# EasyEDA Pro project ProPrj_分电板_2025-04-18.epro

# Schematic Schematic1
Board Name: Board1; Create Date: 2025-04-17; Page Name: P1; Project Name: 分电板; Schematic Name: Schematic1; Update Date: 2025-04-17; Company: 嘉立创EDA; Page Size: A4; Version: V1.0
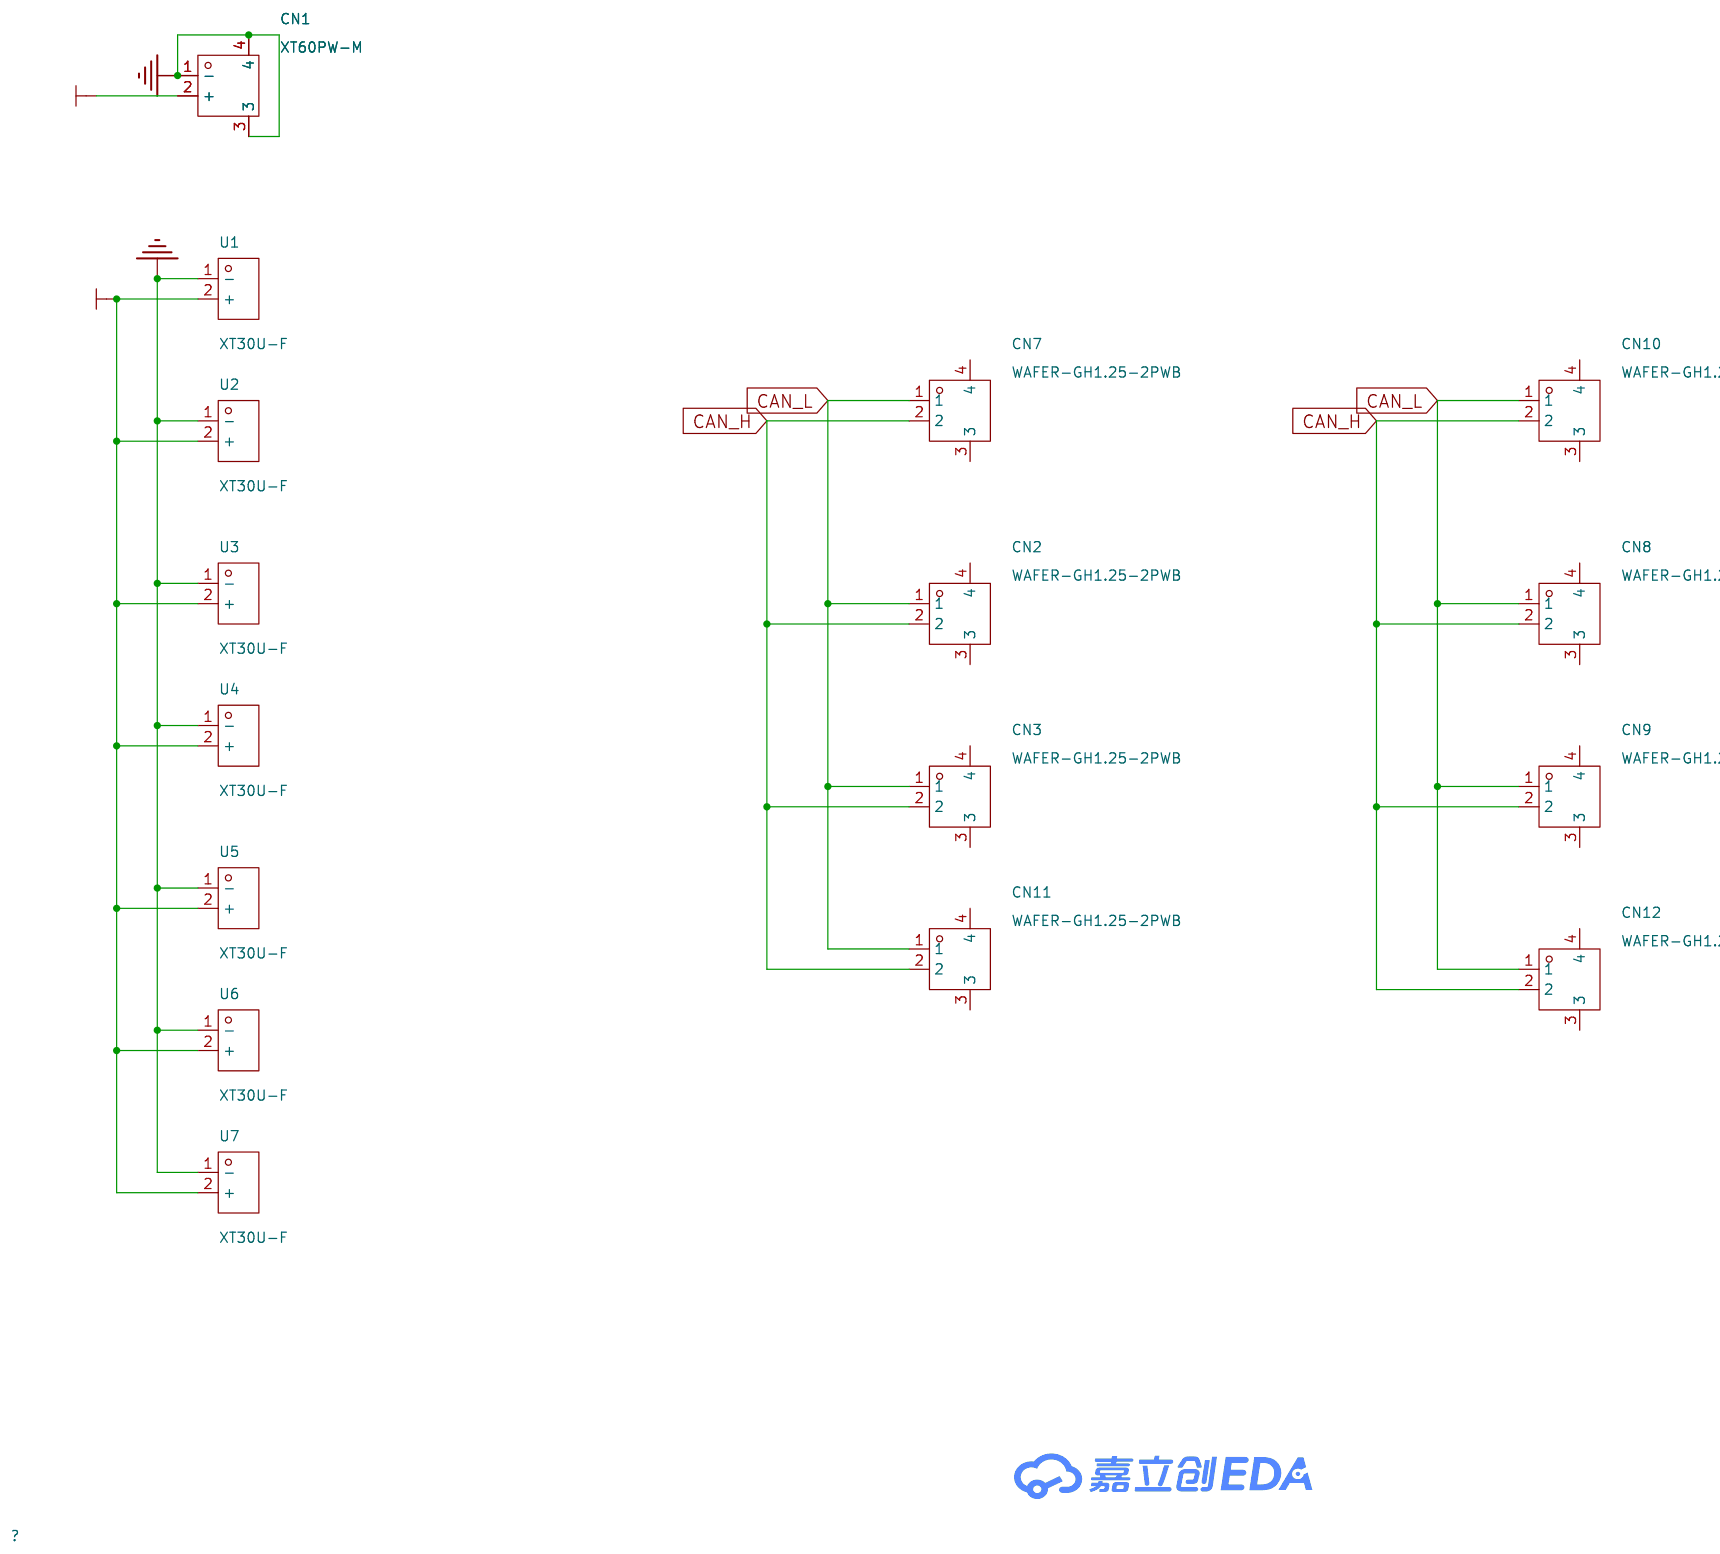
[diagram p0: schematic sheet]

## Parts
CN1  XT60PW-M  [CONN-TH_XT60PW-M]
CN2  WAFER-GH1.25-2PWB  [CONN-TH_2P-P1.25_XUNPU_WAFER-GH1.25-2PWB]
CN3  WAFER-GH1.25-2PWB  [CONN-TH_2P-P1.25_XUNPU_WAFER-GH1.25-2PWB]
CN7  WAFER-GH1.25-2PWB  [CONN-TH_2P-P1.25_XUNPU_WAFER-GH1.25-2PWB]
CN8  WAFER-GH1.25-2PWB  [CONN-TH_2P-P1.25_XUNPU_WAFER-GH1.25-2PWB]
CN9  WAFER-GH1.25-2PWB  [CONN-TH_2P-P1.25_XUNPU_WAFER-GH1.25-2PWB]
CN10  WAFER-GH1.25-2PWB  [CONN-TH_2P-P1.25_XUNPU_WAFER-GH1.25-2PWB]
CN11  WAFER-GH1.25-2PWB  [CONN-TH_2P-P1.25_XUNPU_WAFER-GH1.25-2PWB]
CN12  WAFER-GH1.25-2PWB  [CONN-TH_2P-P1.25_XUNPU_WAFER-GH1.25-2PWB]
U1  XT30U-F  [CONN-TH_XT30U-F]
U2  XT30U-F  [CONN-TH_XT30U-F]
U3  XT30U-F  [CONN-TH_XT30U-F]
U4  XT30U-F  [CONN-TH_XT30U-F]
U5  XT30U-F  [CONN-TH_XT30U-F]
U6  XT30U-F  [CONN-TH_XT30U-F]
U7  XT30U-F  [CONN-TH_XT30U-F]

## Library data of the parts
CN1 = XT60PW-M: 类别:-;类型1:-;; LCSC Part Name: AMASS(艾迈斯)航模插头xt60连接器150公母对接pw锂电池公头 板插卧式XT60PW-M; Supplier Part: C98732; Manufacturer: AMASS(艾迈斯); JLCPCB Part Class: 扩展库; Datasheet: https://atta.szlcsc.com/upload/public/pdf/source/20240118/44A3DCFF53BE25DC65378AFFB21277A4.pdf; Supplier: LCSC; Brand: 艾迈斯; Type: 卧式插头; Colour: 黄色; InterfaceType: 公头
CN2 CN3 CN7-CN12 = WAFER-GH1.25-2PWB: 插针结构:1x2P;间距:1.25mm;安装方式:卧贴;参考系列:GH;总PIN数:2P;排数:1;每排PIN数:2;行距:-;额定电流:1A;触头材质:黄铜;触头镀层:-;工作温度范围:-25℃~+85℃;; LCSC Part Name: 1x2P 间距:1.25mm 卧贴 系列:GH; Supplier Part: C3029377; Manufacturer: XUNPU(讯普); Supplier Footprint: SMD,P=1.25mm,卧贴; JLCPCB Part Class: 扩展库; Datasheet: https://atta.szlcsc.com/upload/public/pdf/source/20220527/CB8773BFB0913C3B8ABD62CB38BA101A.pdf; Supplier: LCSC; Pins Structure: 1x2P; Pitch: 1.25mm; Mounting Type: 卧贴; Reference Series: GH; Number of Pins: 2P; Number of Rows: 1; Number of PINs Per Row: 2; Current Rating: 1A; Contact Material: 黄铜; Operating Temperature: -25℃~+85℃; Voltage Rating: 125V; Plastic Material: LCP; Supplementary Features: 辅助焊脚; Color: 米色; Z-Height of the Board: 4.35mm; X-Length of Bottom Edge on Board (Spacing Line): 5.75mm; Y-Width of Bottom Edge on Board: 5mm
U1-U7 = XT30U-F: 类别:-;类型1:-;; LCSC Part Name: AMASS(艾迈斯)轻量版锂电池插头母头 XT30U-F; Supplier Part: C99102; Manufacturer: AMASS(艾迈斯); JLCPCB Part Class: 扩展库; Datasheet: https://atta.szlcsc.com/upload/public/pdf/source/20190916/C428721_B0ECB8C5937139CEFE8736D2D3175B0E.pdf; Supplier: LCSC; Brand: 艾迈斯; Type: 插头; Colour: 黄色; InterfaceType: 母头

## Nets
GND: CN1.1(-) CN1.3 CN1.4 U1.1(-) U2.1(-) U3.1(-) U4.1(-) U5.1(-) U6.1(-) U7.1(-)
VCC24V: CN1.2(+) U1.2(+) U2.2(+) U3.2(+) U4.2(+) U5.2(+) U6.2(+) U7.2(+)
CAN_H: CN2.2 CN3.2 CN7.2 CN8.2 CN9.2 CN10.2 CN11.2 CN12.2
CAN_L: CN2.1 CN3.1 CN7.1 CN8.1 CN9.1 CN10.1 CN11.1 CN12.1

Not connected (* = marked no-connect by the designer): CN2 3 4; CN3 3 4; CN7 3 4; CN8 3 4; CN9 3 4; CN10 3 4; CN11 3 4; CN12 3 4

# Board PCB1
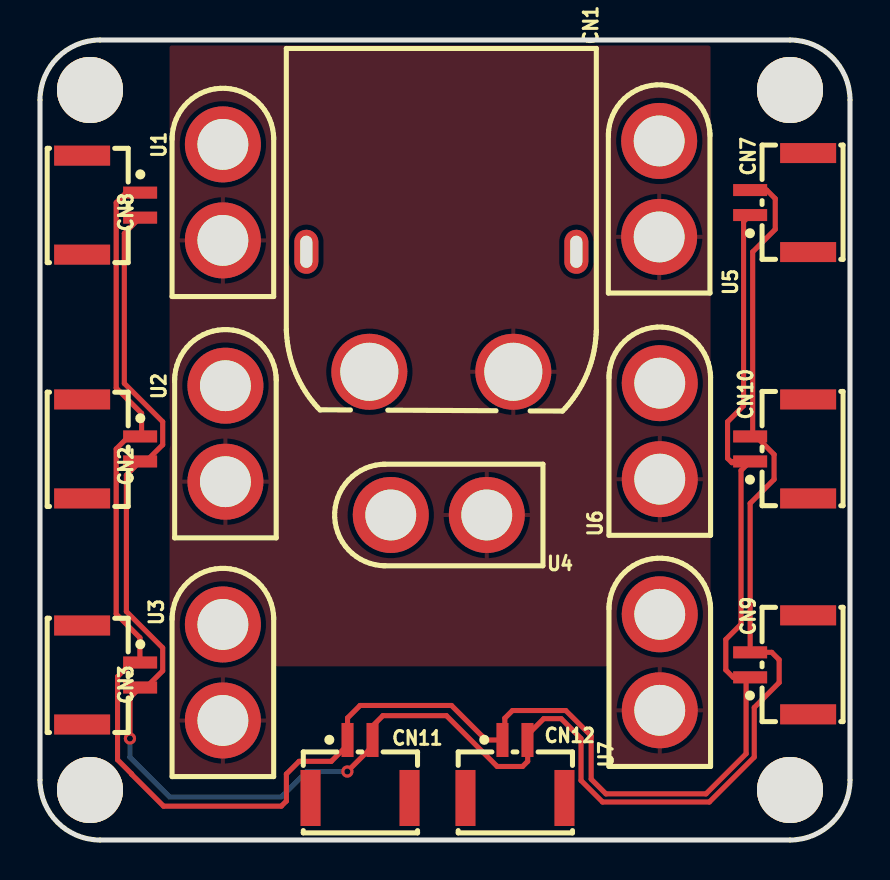
[diagram p1: board, top side]
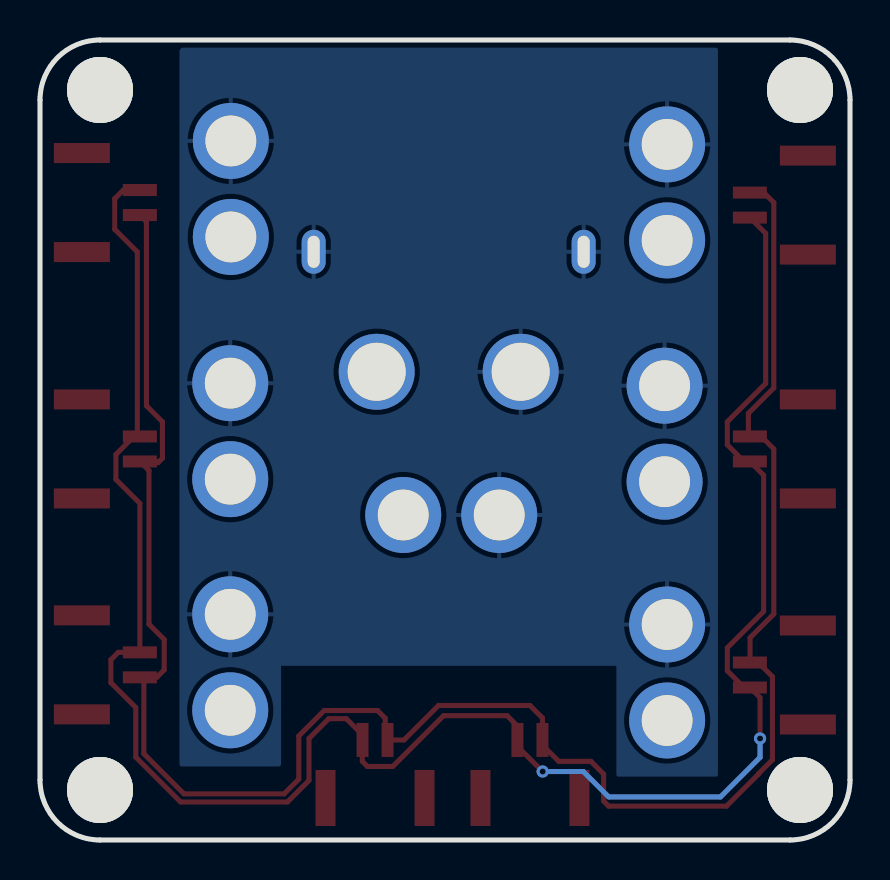
[diagram p2: board, bottom side, seen from below]

Outline 40.5 x 40 mm; copper layers: Top Layer, Bottom Layer. Coordinates in mm from the lower left corner of the outline.
Outline path: 0,37 0,3 arc(0.88,0.88) 3,0 37.5,0 arc(39.62,0.88) 40.5,3 40.5,37 arc(39.62,39.12) 37.5,40 3,40 arc(0.88,39.12) 0,37
Stack: Top Layer 0.035mm / Dielectric1 1.51mm FR4 er 4.5 / Bottom Layer 0.035mm

## Design rules (mm)
template: 自定义配置
spacing copperThickness1oz (default): track to track 0.102, other pairs 0.152 to 0.3
spacing copperThickness2oz: track to track 0.203, other pairs 0.152 to 0.3
track width copperThickness1oz (default): min 0.127, default 0.254, max 2.54
track width copperThickness2oz: min 0.203, default 0.254, max 2.54
differential pair differentialPair (default): width min 0.127, default 0.254, max 2.54; gap min 0.152, default 0.152
via viaSize (default): diameter min 0.5, default 0.61, max 10; hole min 0.3, default 0.305, max 6.3

## Placement (name value [footprint] x y rotation side)
CN1  XT60PW-M  [CONN-TH_XT60PW-M]  20.07 26.41 270 top
CN2  WAFER-GH1.25-2PWB  [CONN-TH_2P-P1.25_XUNPU_WAFER-GH1.25-2PWB]  3.56 19.55 270 top
CN3  WAFER-GH1.25-2PWB  [CONN-TH_2P-P1.25_XUNPU_WAFER-GH1.25-2PWB]  3.56 8.25 270 top
CN7  WAFER-GH1.25-2PWB  [CONN-TH_2P-P1.25_XUNPU_WAFER-GH1.25-2PWB]  36.96 31.87 90 top
CN8  WAFER-GH1.25-2PWB  [CONN-TH_2P-P1.25_XUNPU_WAFER-GH1.25-2PWB]  3.56 31.75 270 top
CN9  WAFER-GH1.25-2PWB  [CONN-TH_2P-P1.25_XUNPU_WAFER-GH1.25-2PWB]  36.96 8.76 90 top
CN10  WAFER-GH1.25-2PWB  [CONN-TH_2P-P1.25_XUNPU_WAFER-GH1.25-2PWB]  36.96 19.55 90 top
CN11  WAFER-GH1.25-2PWB  [CONN-TH_2P-P1.25_XUNPU_WAFER-GH1.25-2PWB]  16 3.55 0 top
CN12  WAFER-GH1.25-2PWB  [CONN-TH_2P-P1.25_XUNPU_WAFER-GH1.25-2PWB]  23.75 3.55 0 top
NOREF  -  [Pad_e21]  37.5 37.5 0 top
NOREF#2  -  [Pad_e23]  37.5 2.5 0 top
NOREF#3  -  [Pad_e19]  2.5 37.5 0 top
NOREF#4  -  [Pad_e22]  2.5 2.5 0 top
U1  XT30U-F  [CONN-TH_XT30U-F]  9.14 32.38 90 top
U2  XT30U-F  [CONN-TH_XT30U-F]  9.27 20.31 90 top
U3  XT30U-F  [CONN-TH_XT30U-F]  9.14 8.38 90 top
U4  XT30U-F  [CONN-TH_XT30U-F]  19.94 16.25 180 top
U5  XT30U-F  [CONN-TH_XT30U-F]  30.96 32.55 90 top
U6  XT30U-F  [CONN-TH_XT30U-F]  30.99 20.44 90 top
U7  XT30U-F  [CONN-TH_XT30U-F]  30.99 8.89 90 top

## Footprints (pads in the part's own frame, mm; a bottom-side part is the same pattern mirrored in y, then rotated)
CONN-TH_2P-P1.25_XUNPU_WAFER-GH1.25-2PWB
  rect 0.6x1.7 smd: 1(-0.625,1.45) 2(0.625,1.45)
  rect 1x2.8 smd: 3(-2.475,-1.45) 4(2.475,-1.45)
CONN-TH_XT30U-F
  round 3.8 hole 2.54: 1(2.4,0) 2(-2.4,0)
CONN-TH_XT60PW-M
  round 3.8 hole 2.9: 1(3,-3.6) 2(3,3.6)
  oval 2.2x1.2 hole 1.6x0.6: 3(-3,6.75) 4(-3,-6.75)
Pad_e19
  round 3.3 hole 3.3: 1(0,0)
Pad_e21
  round 3.3 hole 3.3: 1(0,0)
Pad_e22
  round 3.3 hole 3.3: 1(0,0)
Pad_e23
  round 3.3 hole 3.3: 1(0,0)

## Nets
As in the schematic.

Pads without a net: CN2 3 4; CN3 3 4; CN7 3 4; CN8 3 4; CN9 3 4; CN10 3 4; CN11 3 4; CN12 3 4; NOREF 1; NOREF#2 1; NOREF#3 1; NOREF#4 1

## Via types
v1: diameter 0.61, hole 0.305, Top Layer to Bottom Layer, 2 vias

## Routing (per net, layer and track width the routed paths; a pad name or vN(x,y) marks a point on that pad's centre or on a via; arc(x,y) is an arc through that point)
CAN_H: length 104.5
  Top Layer w0.254: CN7.2 36.33,32.5 36.76,32.07 36.76,30.53 35.63,29.41 35.63,20.31 35.52,20.19 ; v1(15.37,3.42) 16.63,4.68 CN11.2 16.63,5.7 17.15,6.22 20.32,6.22 22.86,3.68 24.13,3.68 24.38,3.93 24.38,4.99 CN12.2 24.37,5.25 25.18,6.07 26.06,6.07 27.05,5.08 27.05,2.98 28.13,1.9 33.47,1.9 35.71,4.14 35.71,6.62 36.96,7.87 36.96,9.01 36.59,9.38 CN9.2 35.51,16.83 36.7,18.03 36.7,19.28 35.79,20.19 35.52,20.19 ; CN10.2 35.52,20.19 ; CN8.2 4.22,30.33 4.22,22.83 6.13,20.91 6.13,19.76 5.3,18.93 CN2.2 4.32,18.24 4.32,11.42 6.13,9.61 6.13,8.46 5.29,7.61 5.02,7.61 CN3.2 4.5,7.12 v1(4.5,5.08)
  Bottom Layer w0.254: v1(15.37,3.42) 13.34,3.42 12.06,2.15 6.48,2.15 4.5,4.13 v1(4.5,5.08)
CAN_L: length 103.8
  Top Layer w0.254: 5,8.89 5,10.11 3.81,11.3 3.81,19.55 4.44,20.18 4.88,20.18 5.08,20.38 5.08,21.33 3.81,22.6 3.81,31.87 4.31,32.37 CN8.1 ; 5,8.89 CN3.1 ; 5,8.89 4.59,8.89 3.88,8.17 3.88,4.01 4.58,3.31 4.58,3.29 6.18,1.69 12.06,1.69 12.32,1.95 12.32,3.3 12.95,3.93 14.56,3.93 15.38,4.75 CN11.1 15.38,6.1 16,6.73 20.57,6.73 22.3,5 CN12.1 23.24,5.12 23.24,6.09 23.62,6.47 26.29,6.47 27.56,5.2 27.56,3.04 28.3,2.31 33.3,2.31 35.31,4.31 35.31,7.93 CN9.1 34.66,8.13 34.29,8.5 34.29,10.03 35.05,10.79 35.05,18.47 CN10.1 34.66,18.93 34.6,18.87 34.38,19.08 34.38,20.91 35.18,21.71 35.18,30.92 CN7.1 ; 4.91,20.15 4.98,20.15 CN2.1

## Copper pours and planes (outline as drawn; the poured copper is in the pictures)
GND on Bottom Layer: 6.6,39.62 6.6,3.17 11.68,3.17 11.68,8.71 28.45,8.71 28.45,3.68 33.53,3.68 33.53,39.49 33.4,39.62
VCC24V on Top Layer: 6.48,39.73 6.48,3.17 11.68,3.17 11.68,8.69 28.38,8.69 28.38,3.68 33.53,3.68 33.53,39.73
